# EAGLE board TD4SMD2 (EAGLE 9.2.2), part 1 of 2
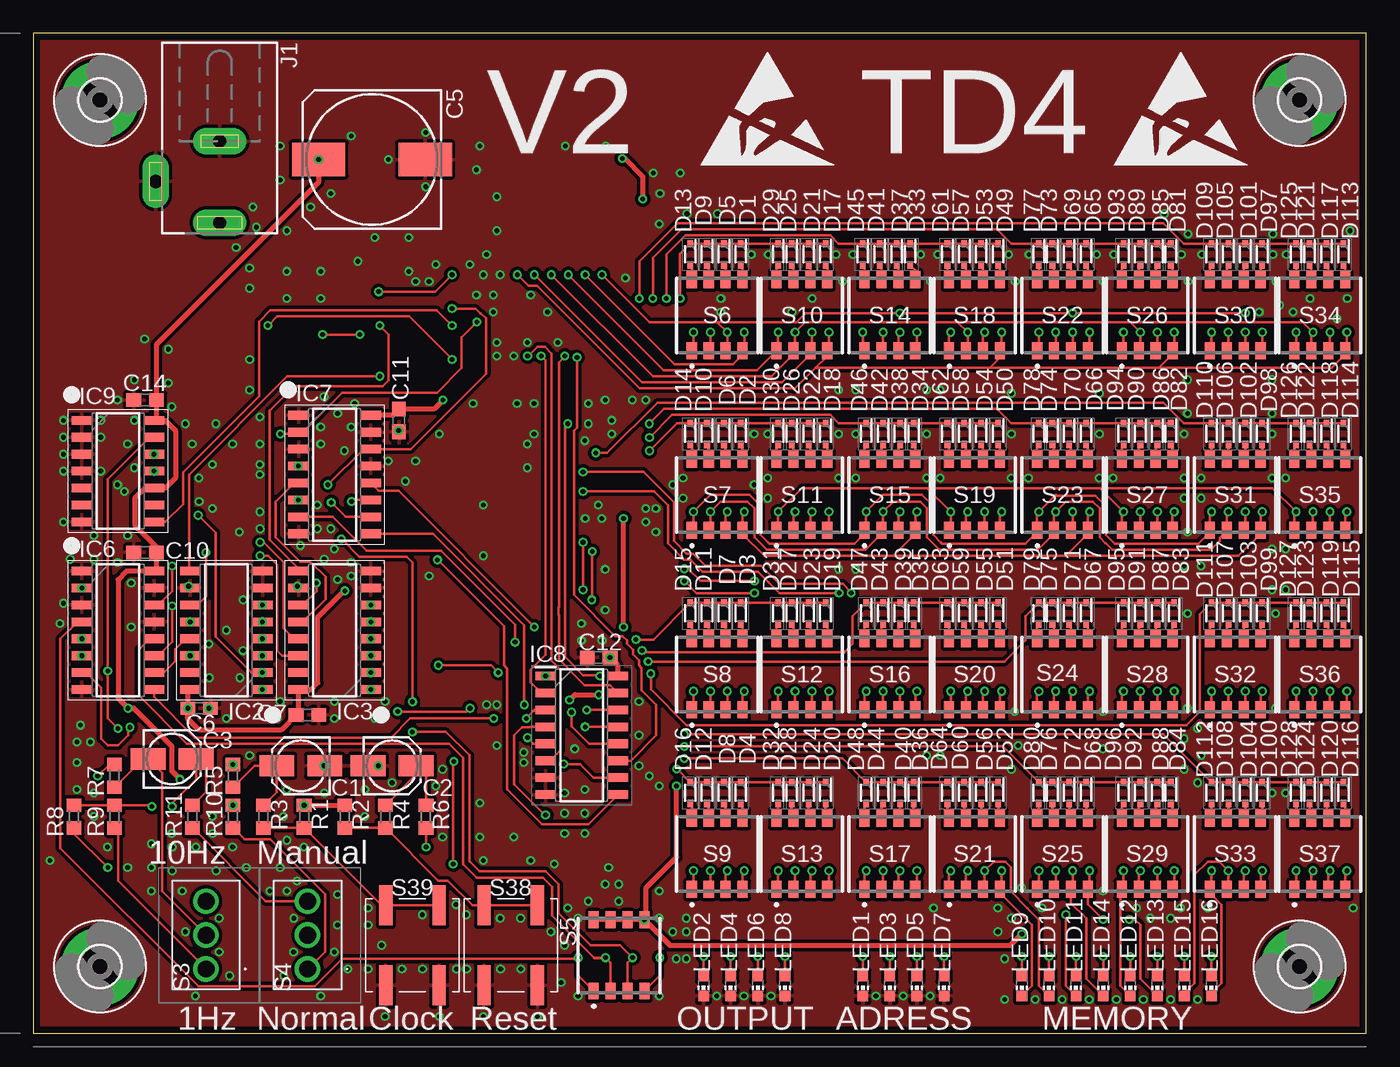
[diagram p2: board, top side]
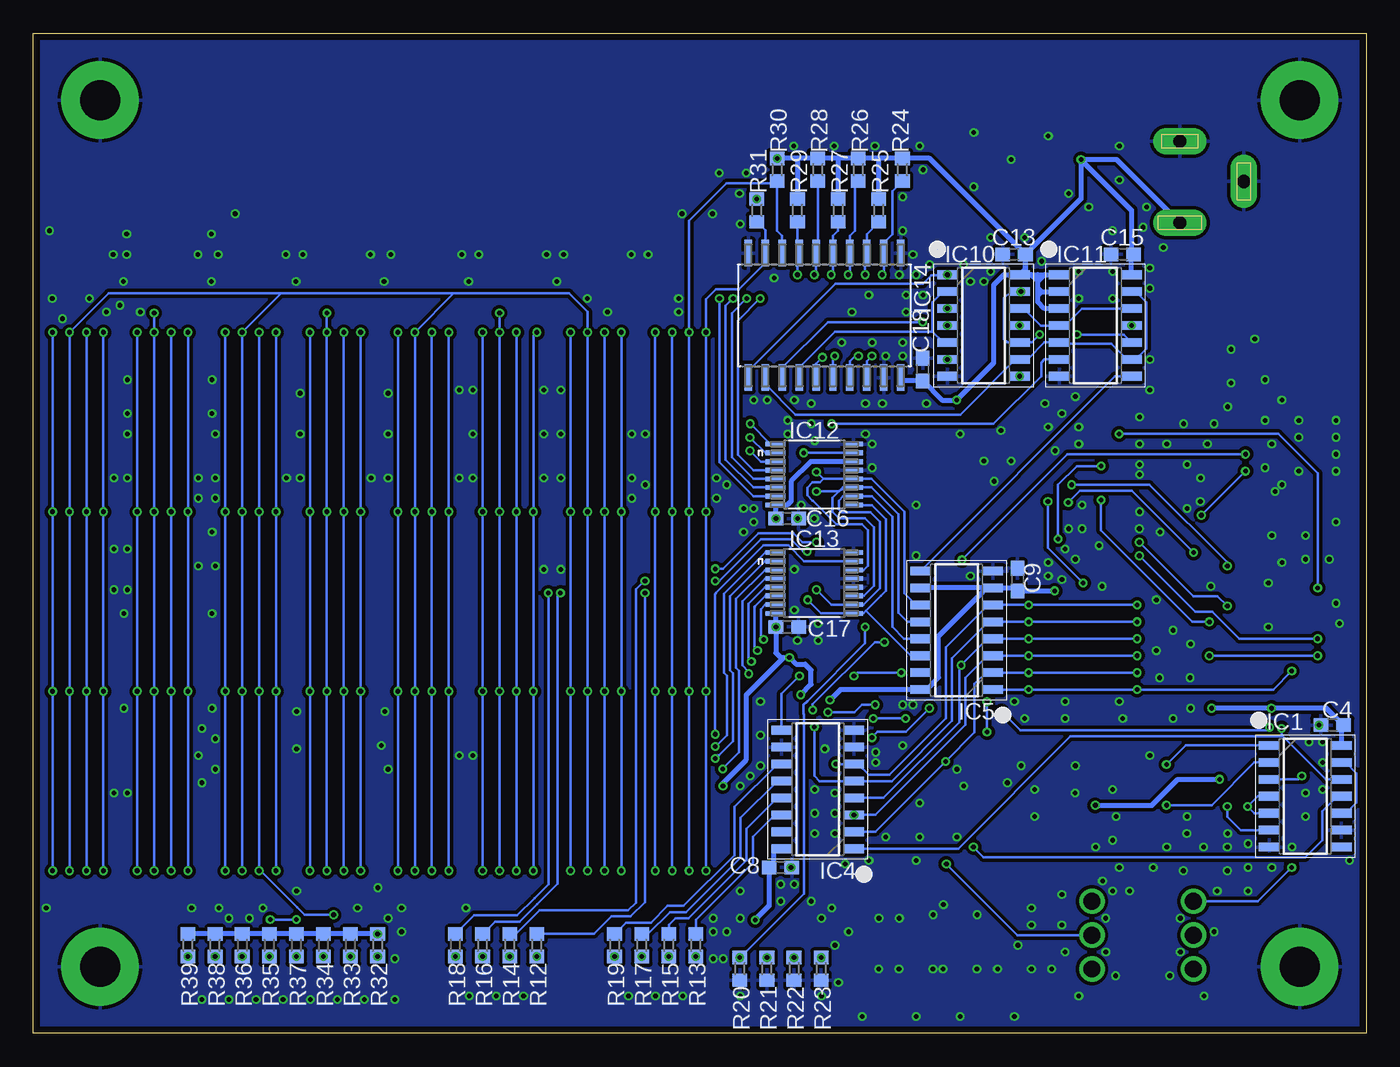
[diagram p3: board, bottom side, seen from below]

Size 100 x 75 mm. Coordinates in mm from the lower left corner, seen from the top.
Outline: 0,0 100,0 100,75 0,75 0,0
Copper layers (1*16): Top 0.035mm / dielectric 1.6mm / Bottom 0.035mm
Design rules "Elecrow_2-layer_PCB_eagle_rule *": minimum track width 6mil, minimum drill 12mil, track to track 8mil, track to pad 8mil, pad to pad 8mil, via to via 8mil, smd to smd 0mil, copper to edge 20mil, drill to drill 10mil, minimum pad ring 6mil, minimum via ring 6mil, stop-mask expansion 0mil, vias tented up to drill 100mil, thermal gap 10mil
Net classes: 0 default: width 0.203 mm, drill 0.203 mm, clearance 0.254 mm; 1 Power: width 0.381 mm, drill 0.203 mm, clearance 0.254 mm

## Footprints (pad centres in the part's own frame; a part is rotated, then mirrored left to right if it is on the bottom)
153CLV-0405 = smd 2.6 x 1.6: + 1.8,0; - -1.8,0
C0603 = smd 1.1 x 1: 1 -0.85,0; 2 0.85,0
153CLV-1010 = smd 4 x 2.5: + 4,0; - -4,0
SODFL1608X70N = smd 0.55 x 0.42: 1 -0.8,0; 2 0.8,0
3,0-PAD = drill 3 pad 5.842: B3,0 0,0
SOIC127P600X175-14N = smd 1.525 x 0.65: 1 -2.712,3.81; 2 -2.712,2.54; 3 -2.712,1.27; 4 -2.712,0; 5 -2.712,-1.27; 6 -2.712,-2.54; 7 -2.712,-3.81; 8 2.712,-3.81; 9 2.712,-2.54; 10 2.712,-1.27; 11 2.712,0; 12 2.712,1.27; 13 2.712,2.54; 14 2.712,3.81
SOIC127P600X175-16N = smd 1.525 x 0.65: 1 -2.712,4.445; 2 -2.712,3.175; 3 -2.712,1.905; 4 -2.712,0.635; 5 -2.712,-0.635; 6 -2.712,-1.905; 7 -2.712,-3.175; 8 -2.712,-4.445; 9 2.712,-4.445; 10 2.712,-3.175; 11 2.712,-1.905; 12 2.712,-0.635; 13 2.712,0.635; 14 2.712,1.905; 15 2.712,3.175; 16 2.712,4.445
SOP65P640X120-16N = smd 1.473 x 0.356: 1 -2.921,2.286; 2 -2.921,1.626; 3 -2.921,0.965; 4 -2.921,0.33; 5 -2.921,-0.33; 6 -2.921,-0.965; 7 -2.921,-1.626; 8 -2.921,-2.286; 9 2.921,-2.286; 10 2.921,-1.626; 11 2.921,-0.965; 12 2.921,-0.33; 13 2.921,0.33; 14 2.921,0.965; 15 2.921,1.626; 16 2.921,2.286
SOIC127P1030X265-20N = smd 1.981 x 0.559: 1 -4.674,5.715; 2 -4.674,4.445; 3 -4.674,3.175; 4 -4.674,1.905; 5 -4.674,0.635; 6 -4.674,-0.635; 7 -4.674,-1.905; 8 -4.674,-3.175; 9 -4.674,-4.445; 10 -4.674,-5.715; 11 4.674,-5.715; 12 4.674,-4.445; 13 4.674,-3.175; 14 4.674,-1.905; 15 4.674,-0.635; 16 4.674,0.635; 17 4.674,1.905; 18 4.674,3.175; 19 4.674,4.445; 20 4.674,5.715
DCJ0202 = drill 1 pad 2 long: 1 0,3.1; 2 4.8,0; 3 0,-3
CHIP-LED0603 = smd 0.8 x 0.8: A 0,-0.75; C 0,0.75
R0603 = smd 1 x 1.1: 1 -0.85,0; 2 0.85,0
2MS1T2B4M2QES = drill 1.27 pad 1.905: 1 0,0; 2 0,2.54; 3 0,5.08
DHS904J = smd 0.76 x 1.27: 1 -1.905,-2.665; 2 -0.635,-2.665; 3 0.635,-2.665; 4 1.905,-2.665; 5 1.905,2.665; 6 0.635,2.665; 7 -0.635,2.665; 8 -1.905,2.665
KSC = smd 3 x 1: 1 -3,2; 2 -3,-2; 3 3,-2; 4 3,2

## Placement (x,y rotation side)
C1  10uF  [153CLV-0405]  20.07,20.07 180 top
C2  10uF  [153CLV-0405]  26.92,20.07 0 top
C3  10uF  [153CLV-0405]  10.41,20.57 0 top
C4  0.1uF  [C0603]  2.54,23.11 0 bottom
C5  100uF  [153CLV-1010]  25.4,65.53 180 top
C6  0.1uF  [C0603]  12.45,24.38 180 top
C7  0.1uF  [C0603]  20.57,23.88 180 top
C8  0.1uF  [C0603]  43.94,12.45 180 bottom
C9  0.1uF  [C0603]  26.16,34.04 270 bottom
C10  0.1uF  [C0603]  8.38,36.07 0 top
C11  0.1uF  [C0603]  27.43,45.97 90 top
C12  0.1uF  [C0603]  42.42,28.19 180 top
C13  0.1uF  [C0603]  26.42,58.42 0 bottom
C14  0.1uF  [C0603]  8.38,47.5 0 top
C15  0.1uF  [C0603]  18.29,58.42 0 bottom
C16  0.1uF  [C0603]  43.43,38.61 0 bottom
C17  0.1uF  [C0603]  43.43,30.48 0 bottom
C18  0.1uF  [C0603]  33.27,49.78 270 bottom
D1  RB751S-40TE61  [SODFL1608X70N]  53.09,58.42 270 top
D2  RB751S-40TE61  [SODFL1608X70N]  53.09,44.96 270 top
D3  RB751S-40TE61  [SODFL1608X70N]  53.09,31.5 270 top
D4  RB751S-40TE61  [SODFL1608X70N]  53.09,18.03 270 top
D5  RB751S-40TE61  [SODFL1608X70N]  51.82,58.42 270 top
D6  RB751S-40TE61  [SODFL1608X70N]  51.82,44.96 270 top
D7  RB751S-40TE61  [SODFL1608X70N]  51.82,31.5 270 top
D8  RB751S-40TE61  [SODFL1608X70N]  51.82,18.03 270 top
D9  RB751S-40TE61  [SODFL1608X70N]  50.55,58.42 270 top
D10  RB751S-40TE61  [SODFL1608X70N]  50.55,44.96 270 top
D11  RB751S-40TE61  [SODFL1608X70N]  50.55,31.5 270 top
D12  RB751S-40TE61  [SODFL1608X70N]  50.55,18.03 270 top
D13  RB751S-40TE61  [SODFL1608X70N]  49.28,58.42 270 top
D14  RB751S-40TE61  [SODFL1608X70N]  49.28,44.96 270 top
D15  RB751S-40TE61  [SODFL1608X70N]  49.28,31.5 270 top
D16  RB751S-40TE61  [SODFL1608X70N]  49.28,18.03 270 top
D17  RB751S-40TE61  [SODFL1608X70N]  59.44,58.42 270 top
D18  RB751S-40TE61  [SODFL1608X70N]  59.44,44.96 270 top
D19  RB751S-40TE61  [SODFL1608X70N]  59.44,31.5 270 top
D20  RB751S-40TE61  [SODFL1608X70N]  59.44,18.03 270 top
D21  RB751S-40TE61  [SODFL1608X70N]  58.17,58.42 270 top
D22  RB751S-40TE61  [SODFL1608X70N]  58.17,44.96 270 top
D23  RB751S-40TE61  [SODFL1608X70N]  58.17,31.5 270 top
D24  RB751S-40TE61  [SODFL1608X70N]  58.17,18.03 270 top
D25  RB751S-40TE61  [SODFL1608X70N]  56.9,58.42 270 top
D26  RB751S-40TE61  [SODFL1608X70N]  56.9,44.96 270 top
D27  RB751S-40TE61  [SODFL1608X70N]  56.9,31.5 270 top
D28  RB751S-40TE61  [SODFL1608X70N]  56.9,18.03 270 top
D29  RB751S-40TE61  [SODFL1608X70N]  55.88,58.42 270 top
D30  RB751S-40TE61  [SODFL1608X70N]  55.88,44.96 270 top
D31  RB751S-40TE61  [SODFL1608X70N]  55.88,31.5 270 top
D32  RB751S-40TE61  [SODFL1608X70N]  55.88,18.03 270 top
D33  RB751S-40TE61  [SODFL1608X70N]  65.79,58.42 270 top
D34  RB751S-40TE61  [SODFL1608X70N]  66.04,44.96 270 top
D35  RB751S-40TE61  [SODFL1608X70N]  66.04,31.5 270 top
D36  RB751S-40TE61  [SODFL1608X70N]  66.04,18.03 270 top
D37  RB751S-40TE61  [SODFL1608X70N]  64.77,58.42 270 top
D38  RB751S-40TE61  [SODFL1608X70N]  65.02,44.96 270 top
D39  RB751S-40TE61  [SODFL1608X70N]  65.02,31.5 270 top
D40  RB751S-40TE61  [SODFL1608X70N]  65.02,18.03 270 top
D41  RB751S-40TE61  [SODFL1608X70N]  63.5,58.42 270 top
D42  RB751S-40TE61  [SODFL1608X70N]  63.75,44.96 270 top
D43  RB751S-40TE61  [SODFL1608X70N]  63.75,31.5 270 top
D44  RB751S-40TE61  [SODFL1608X70N]  63.75,18.03 270 top
D45  RB751S-40TE61  [SODFL1608X70N]  62.23,58.42 270 top
D46  RB751S-40TE61  [SODFL1608X70N]  62.48,44.96 270 top
D47  RB751S-40TE61  [SODFL1608X70N]  62.48,31.5 270 top
D48  RB751S-40TE61  [SODFL1608X70N]  62.48,18.03 270 top
D49  RB751S-40TE61  [SODFL1608X70N]  72.39,58.42 270 top
D50  RB751S-40TE61  [SODFL1608X70N]  72.39,44.96 270 top
D51  RB751S-40TE61  [SODFL1608X70N]  72.39,31.5 270 top
D52  RB751S-40TE61  [SODFL1608X70N]  72.39,18.03 270 top
D53  RB751S-40TE61  [SODFL1608X70N]  71.12,58.42 270 top
D54  RB751S-40TE61  [SODFL1608X70N]  71.12,44.96 270 top
D55  RB751S-40TE61  [SODFL1608X70N]  71.12,31.5 270 top
D56  RB751S-40TE61  [SODFL1608X70N]  71.12,18.03 270 top
D57  RB751S-40TE61  [SODFL1608X70N]  69.85,58.42 270 top
D58  RB751S-40TE61  [SODFL1608X70N]  69.85,44.96 270 top
D59  RB751S-40TE61  [SODFL1608X70N]  69.85,31.5 270 top
D60  RB751S-40TE61  [SODFL1608X70N]  69.85,18.03 270 top
D61  RB751S-40TE61  [SODFL1608X70N]  68.58,58.42 270 top
D62  RB751S-40TE61  [SODFL1608X70N]  68.58,44.96 270 top
D63  RB751S-40TE61  [SODFL1608X70N]  68.58,31.5 270 top
D64  RB751S-40TE61  [SODFL1608X70N]  68.58,18.03 270 top
D65  RB751S-40TE61  [SODFL1608X70N]  78.99,58.42 270 top
D66  RB751S-40TE61  [SODFL1608X70N]  78.99,44.96 270 top
D67  RB751S-40TE61  [SODFL1608X70N]  78.99,31.5 270 top
D68  RB751S-40TE61  [SODFL1608X70N]  78.99,18.03 270 top
D69  RB751S-40TE61  [SODFL1608X70N]  77.72,58.42 270 top
D70  RB751S-40TE61  [SODFL1608X70N]  77.72,44.96 270 top
D71  RB751S-40TE61  [SODFL1608X70N]  77.72,31.5 270 top
D72  RB751S-40TE61  [SODFL1608X70N]  77.72,18.03 270 top
D73  RB751S-40TE61  [SODFL1608X70N]  76.45,58.42 270 top
D74  RB751S-40TE61  [SODFL1608X70N]  76.45,44.96 270 top
D75  RB751S-40TE61  [SODFL1608X70N]  76.45,31.5 270 top
D76  RB751S-40TE61  [SODFL1608X70N]  76.45,18.03 270 top
D77  RB751S-40TE61  [SODFL1608X70N]  75.44,58.42 270 top
D78  RB751S-40TE61  [SODFL1608X70N]  75.44,44.96 270 top
D79  RB751S-40TE61  [SODFL1608X70N]  75.44,31.5 270 top
D80  RB751S-40TE61  [SODFL1608X70N]  75.44,18.03 270 top
D81  RB751S-40TE61  [SODFL1608X70N]  85.34,58.42 270 top
D82  RB751S-40TE61  [SODFL1608X70N]  85.34,44.96 270 top
D83  RB751S-40TE61  [SODFL1608X70N]  85.6,31.5 270 top
D84  RB751S-40TE61  [SODFL1608X70N]  85.34,18.03 270 top
D85  RB751S-40TE61  [SODFL1608X70N]  84.33,58.42 270 top
D86  RB751S-40TE61  [SODFL1608X70N]  84.33,44.96 270 top
D87  RB751S-40TE61  [SODFL1608X70N]  84.33,31.5 270 top
D88  RB751S-40TE61  [SODFL1608X70N]  84.33,18.03 270 top
D89  RB751S-40TE61  [SODFL1608X70N]  83.06,58.42 270 top
D90  RB751S-40TE61  [SODFL1608X70N]  83.06,44.96 270 top
D91  RB751S-40TE61  [SODFL1608X70N]  83.06,31.5 270 top
D92  RB751S-40TE61  [SODFL1608X70N]  83.06,18.03 270 top
D93  RB751S-40TE61  [SODFL1608X70N]  81.79,58.42 270 top
D94  RB751S-40TE61  [SODFL1608X70N]  81.79,44.96 270 top
D95  RB751S-40TE61  [SODFL1608X70N]  81.79,31.5 270 top
D96  RB751S-40TE61  [SODFL1608X70N]  81.79,18.03 270 top
D97  RB751S-40TE61  [SODFL1608X70N]  92.2,58.42 270 top
D98  RB751S-40TE61  [SODFL1608X70N]  92.2,44.96 270 top
D99  RB751S-40TE61  [SODFL1608X70N]  92.2,31.5 270 top
D100  RB751S-40TE61  [SODFL1608X70N]  92.2,18.03 270 top
D101  RB751S-40TE61  [SODFL1608X70N]  90.93,58.42 270 top
D102  RB751S-40TE61  [SODFL1608X70N]  90.93,44.96 270 top
D103  RB751S-40TE61  [SODFL1608X70N]  90.93,31.5 270 top
D104  RB751S-40TE61  [SODFL1608X70N]  90.93,18.03 270 top
D105  RB751S-40TE61  [SODFL1608X70N]  89.66,58.42 270 top
D106  RB751S-40TE61  [SODFL1608X70N]  89.66,44.96 270 top
D107  RB751S-40TE61  [SODFL1608X70N]  89.66,31.5 270 top
D108  RB751S-40TE61  [SODFL1608X70N]  89.66,18.03 270 top
D109  RB751S-40TE61  [SODFL1608X70N]  88.39,58.42 270 top
D110  RB751S-40TE61  [SODFL1608X70N]  88.39,44.96 270 top
D111  RB751S-40TE61  [SODFL1608X70N]  88.39,31.5 270 top
D112  RB751S-40TE61  [SODFL1608X70N]  88.39,18.03 270 top
D113  RB751S-40TE61  [SODFL1608X70N]  98.3,58.42 270 top
D114  RB751S-40TE61  [SODFL1608X70N]  98.3,44.96 270 top
D115  RB751S-40TE61  [SODFL1608X70N]  98.3,31.5 270 top
D116  RB751S-40TE61  [SODFL1608X70N]  98.3,18.03 270 top
D117  RB751S-40TE61  [SODFL1608X70N]  97.03,58.42 270 top
D118  RB751S-40TE61  [SODFL1608X70N]  97.03,44.96 270 top
D119  RB751S-40TE61  [SODFL1608X70N]  97.03,31.5 270 top
D120  RB751S-40TE61  [SODFL1608X70N]  97.03,18.03 270 top
D121  RB751S-40TE61  [SODFL1608X70N]  95.76,58.42 270 top
D122  RB751S-40TE61  [SODFL1608X70N]  95.76,44.96 270 top
D123  RB751S-40TE61  [SODFL1608X70N]  95.76,31.5 270 top
D124  RB751S-40TE61  [SODFL1608X70N]  95.76,18.03 270 top
D125  RB751S-40TE61  [SODFL1608X70N]  94.74,58.42 270 top
D126  RB751S-40TE61  [SODFL1608X70N]  94.74,44.96 270 top
D127  RB751S-40TE61  [SODFL1608X70N]  94.74,31.5 270 top
D128  RB751S-40TE61  [SODFL1608X70N]  94.74,18.03 270 top
H1  MOUNT-PAD-ROUND3.0  [3,0-PAD]  5,5 0 top
H2  MOUNT-PAD-ROUND3.0  [3,0-PAD]  95,5 0 top
H3  MOUNT-PAD-ROUND3.0  [3,0-PAD]  95,70 0 top
H4  MOUNT-PAD-ROUND3.0  [3,0-PAD]  5,70 0 top
IC1  SN74HC14D  [SOIC127P600X175-14N]  4.57,17.78 0 bottom
IC2  SN74HC161D  [SOIC127P600X175-16N]  14.48,30.23 180 top
IC3  SN74HC161D  [SOIC127P600X175-16N]  22.61,30.23 180 top
IC4  SN74HC161D  [SOIC127P600X175-16N]  41.15,18.29 180 bottom
IC5  SN74HC161D  [SOIC127P600X175-16N]  30.73,30.23 180 bottom
IC6  SN74HC153D  [SOIC127P600X175-16N]  6.35,30.23 0 top
IC7  SN74HC153D  [SOIC127P600X175-16N]  22.61,41.91 0 top
IC8  CD74HC283M96  [SOIC127P600X175-16N]  41.15,22.35 0 top
IC9  CD74HC74M  [SOIC127P600X175-14N]  6.35,42.16 0 top
IC10  SN74HCT32D  [SOIC127P600X175-14N]  28.7,53.09 0 bottom
IC11  SN74HC10DR  [SOIC127P600X175-14N]  20.32,53.09 0 bottom
IC12  SN74HC138PW  [SOP65P640X120-16N]  41.4,41.91 180 bottom
IC13  SN74HC138PW  [SOP65P640X120-16N]  41.4,33.78 180 bottom
IC14  SN74HC540DWR  [SOIC127P1030X265-20N]  40.64,53.85 270 bottom
J1  DCJ0202  [DCJ0202]  13.99,63.9 180 top
LED1  [CHIP-LED0603]  62.23,3.56 180 top
LED2  [CHIP-LED0603]  50.29,3.56 180 top
LED3  [CHIP-LED0603]  64.26,3.56 180 top
LED4  [CHIP-LED0603]  52.32,3.56 180 top
LED5  [CHIP-LED0603]  66.29,3.56 180 top
LED6  [CHIP-LED0603]  54.36,3.56 180 top
LED7  [CHIP-LED0603]  68.33,3.56 180 top
LED8  [CHIP-LED0603]  56.39,3.56 180 top
LED9  [CHIP-LED0603]  74.17,3.56 180 top
LED10  [CHIP-LED0603]  76.2,3.56 180 top
LED11  [CHIP-LED0603]  78.23,3.56 180 top
LED12  [CHIP-LED0603]  82.3,3.56 180 top
LED13  [CHIP-LED0603]  84.33,3.56 180 top
LED14  [CHIP-LED0603]  80.26,3.56 180 top
LED15  [CHIP-LED0603]  86.36,3.56 180 top
LED16  [CHIP-LED0603]  88.39,3.56 180 top
R1  1K  [R0603]  20.32,16.26 90 top
R2  1K  [R0603]  23.37,16.26 90 top
R3  10K  [R0603]  17.27,16.26 90 top
R4  100K  [R0603]  26.42,16.26 90 top
R5  100K  [R0603]  14.99,19.3 90 top
R6  100K  [R0603]  29.46,16.26 270 top
R7  100K  [R0603]  6.1,19.3 90 top
R8  3.3K  [R0603]  3.05,16.26 90 top
R9  33K  [R0603]  6.1,16.26 90 top
R10  100  [R0603]  14.99,16.26 270 top
R11  100  [R0603]  11.94,16.26 270 top
R12  1K  [R0603]  62.23,6.6 90 bottom
R13  1K  [R0603]  50.29,6.6 90 bottom
R14  1K  [R0603]  64.26,6.6 90 bottom
R15  1K  [R0603]  52.32,6.6 90 bottom
R16  1K  [R0603]  66.29,6.6 90 bottom
R17  1K  [R0603]  54.36,6.6 90 bottom
R18  1K  [R0603]  68.33,6.6 90 bottom
R19  1K  [R0603]  56.39,6.6 90 bottom
R20  1K  [R0603]  46.99,4.83 270 bottom
R21  1K  [R0603]  44.96,4.83 270 bottom
R22  1K  [R0603]  42.93,4.83 270 bottom
R23  1K  [R0603]  40.89,4.83 270 bottom
R24  10K  [R0603]  34.8,64.77 90 bottom
R25  10K  [R0603]  36.58,61.72 90 bottom
R26  10K  [R0603]  38.1,64.77 90 bottom
R27  10K  [R0603]  39.62,61.72 90 bottom
R28  10K  [R0603]  41.15,64.77 90 bottom
R29  10K  [R0603]  42.67,61.72 90 bottom
R30  10K  [R0603]  44.2,64.77 90 bottom
R31  10K  [R0603]  45.72,61.72 90 bottom
R32  1K  [R0603]  74.17,6.6 90 bottom
R33  1K  [R0603]  76.2,6.6 90 bottom
R34  1K  [R0603]  78.23,6.6 90 bottom
R35  1K  [R0603]  82.3,6.6 90 bottom
R36  1K  [R0603]  84.33,6.6 90 bottom
R37  1K  [R0603]  80.26,6.6 90 bottom
R38  1K  [R0603]  86.36,6.6 90 bottom
R39  1K  [R0603]  88.39,6.6 90 bottom
S3  2MS1-T2-B4-M2-Q-E-S  [2MS1T2B4M2QES]  12.95,4.83 0 top
S4  2MS1-T2-B4-M2-Q-E-S  [2MS1T2B4M2QES]  20.57,4.83 0 top
S5  DHS904J  [DHS904J]  43.94,5.84 0 top
S6  DHS904J  [DHS904J]  51.31,53.85 0 top
S7  DHS904J  [DHS904J]  51.31,40.39 0 top
S8  DHS904J  [DHS904J]  51.31,26.92 0 top
S9  DHS904J  [DHS904J]  51.31,13.46 0 top
S10  DHS904J  [DHS904J]  57.66,53.85 0 top
S11  DHS904J  [DHS904J]  57.66,40.39 0 top
S12  DHS904J  [DHS904J]  57.66,26.92 0 top
S13  DHS904J  [DHS904J]  57.66,13.46 0 top
S14  DHS904J  [DHS904J]  64.26,53.85 0 top
S15  DHS904J  [DHS904J]  64.26,40.39 0 top
S16  DHS904J  [DHS904J]  64.26,26.92 0 top
S17  DHS904J  [DHS904J]  64.26,13.46 0 top
S18  DHS904J  [DHS904J]  70.61,53.85 0 top
S19  DHS904J  [DHS904J]  70.61,40.39 0 top
S20  DHS904J  [DHS904J]  70.61,26.92 0 top
S21  DHS904J  [DHS904J]  70.61,13.46 0 top
S22  DHS904J  [DHS904J]  77.22,53.85 0 top
S23  DHS904J  [DHS904J]  77.22,40.39 0 top
S24  DHS904J  [DHS904J]  77.22,26.92 0 top
S25  DHS904J  [DHS904J]  77.22,13.46 0 top
S26  DHS904J  [DHS904J]  83.57,53.85 0 top
S27  DHS904J  [DHS904J]  83.57,40.39 0 top
S28  DHS904J  [DHS904J]  83.57,26.92 0 top
S29  DHS904J  [DHS904J]  83.57,13.46 0 top
S30  DHS904J  [DHS904J]  90.17,53.85 0 top
S31  DHS904J  [DHS904J]  90.17,40.39 0 top
S32  DHS904J  [DHS904J]  90.17,26.92 0 top
S33  DHS904J  [DHS904J]  90.17,13.46 0 top
S34  DHS904J  [DHS904J]  96.52,53.85 0 top
S35  DHS904J  [DHS904J]  96.52,40.39 0 top
S36  DHS904J  [DHS904J]  96.52,26.92 0 top
S37  DHS904J  [DHS904J]  96.52,13.46 0 top
S38  KSC  [KSC]  35.81,6.6 90 top
S39  KSC  [KSC]  28.45,6.6 90 top
U$1  [ESD_10.00]  50,65 0 top
U$2  [ESD_10.00]  81,65 0 top